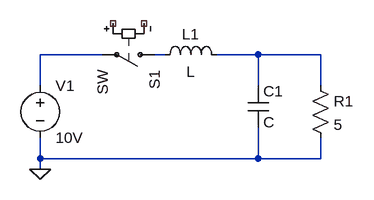
[diagram p0: schematic Draft1.asc]
Draft1.asc, the LTspice schematic file:
Version 4
SHEET 1 880 680
WIRE 96 176 0 176
WIRE 192 176 176 176
WIRE 336 176 272 176
WIRE 432 176 336 176
WIRE 0 224 0 176
WIRE 336 224 336 176
WIRE 432 224 432 176
WIRE 0 336 0 304
WIRE 336 336 336 288
WIRE 336 336 0 336
WIRE 432 336 432 304
WIRE 432 336 336 336
WIRE 0 352 0 336
FLAG 0 352 0
SYMBOL sw 192 176 R90
SYMATTR InstName S1
SYMBOL voltage 0 208 R0
SYMATTR InstName V1
SYMATTR Value 10V
SYMBOL res 416 208 R0
SYMATTR InstName R1
SYMATTR Value 5
SYMBOL ind 176 192 R270
WINDOW 0 32 56 VTop 2
WINDOW 3 5 56 VBottom 2
SYMATTR InstName L1
SYMBOL cap 320 224 R0
SYMATTR InstName C1

The netlist it stands for:
* Draft1.asc
S1 N002 N001 NC_01 NC_02 SW
V1 N001 0 10V
R1 N003 0 5
L1 N002 N003 L
C1 N003 0 C
.backanno
.end